# EasyEDA schematic SCH_analog_2025-01-25.json
TITLE: Sheet_1; REV: 1.0; Date: 2025-01-24; Sheet: 1/1; Drawn By: tidaschandoopasilva; Company: Your Company
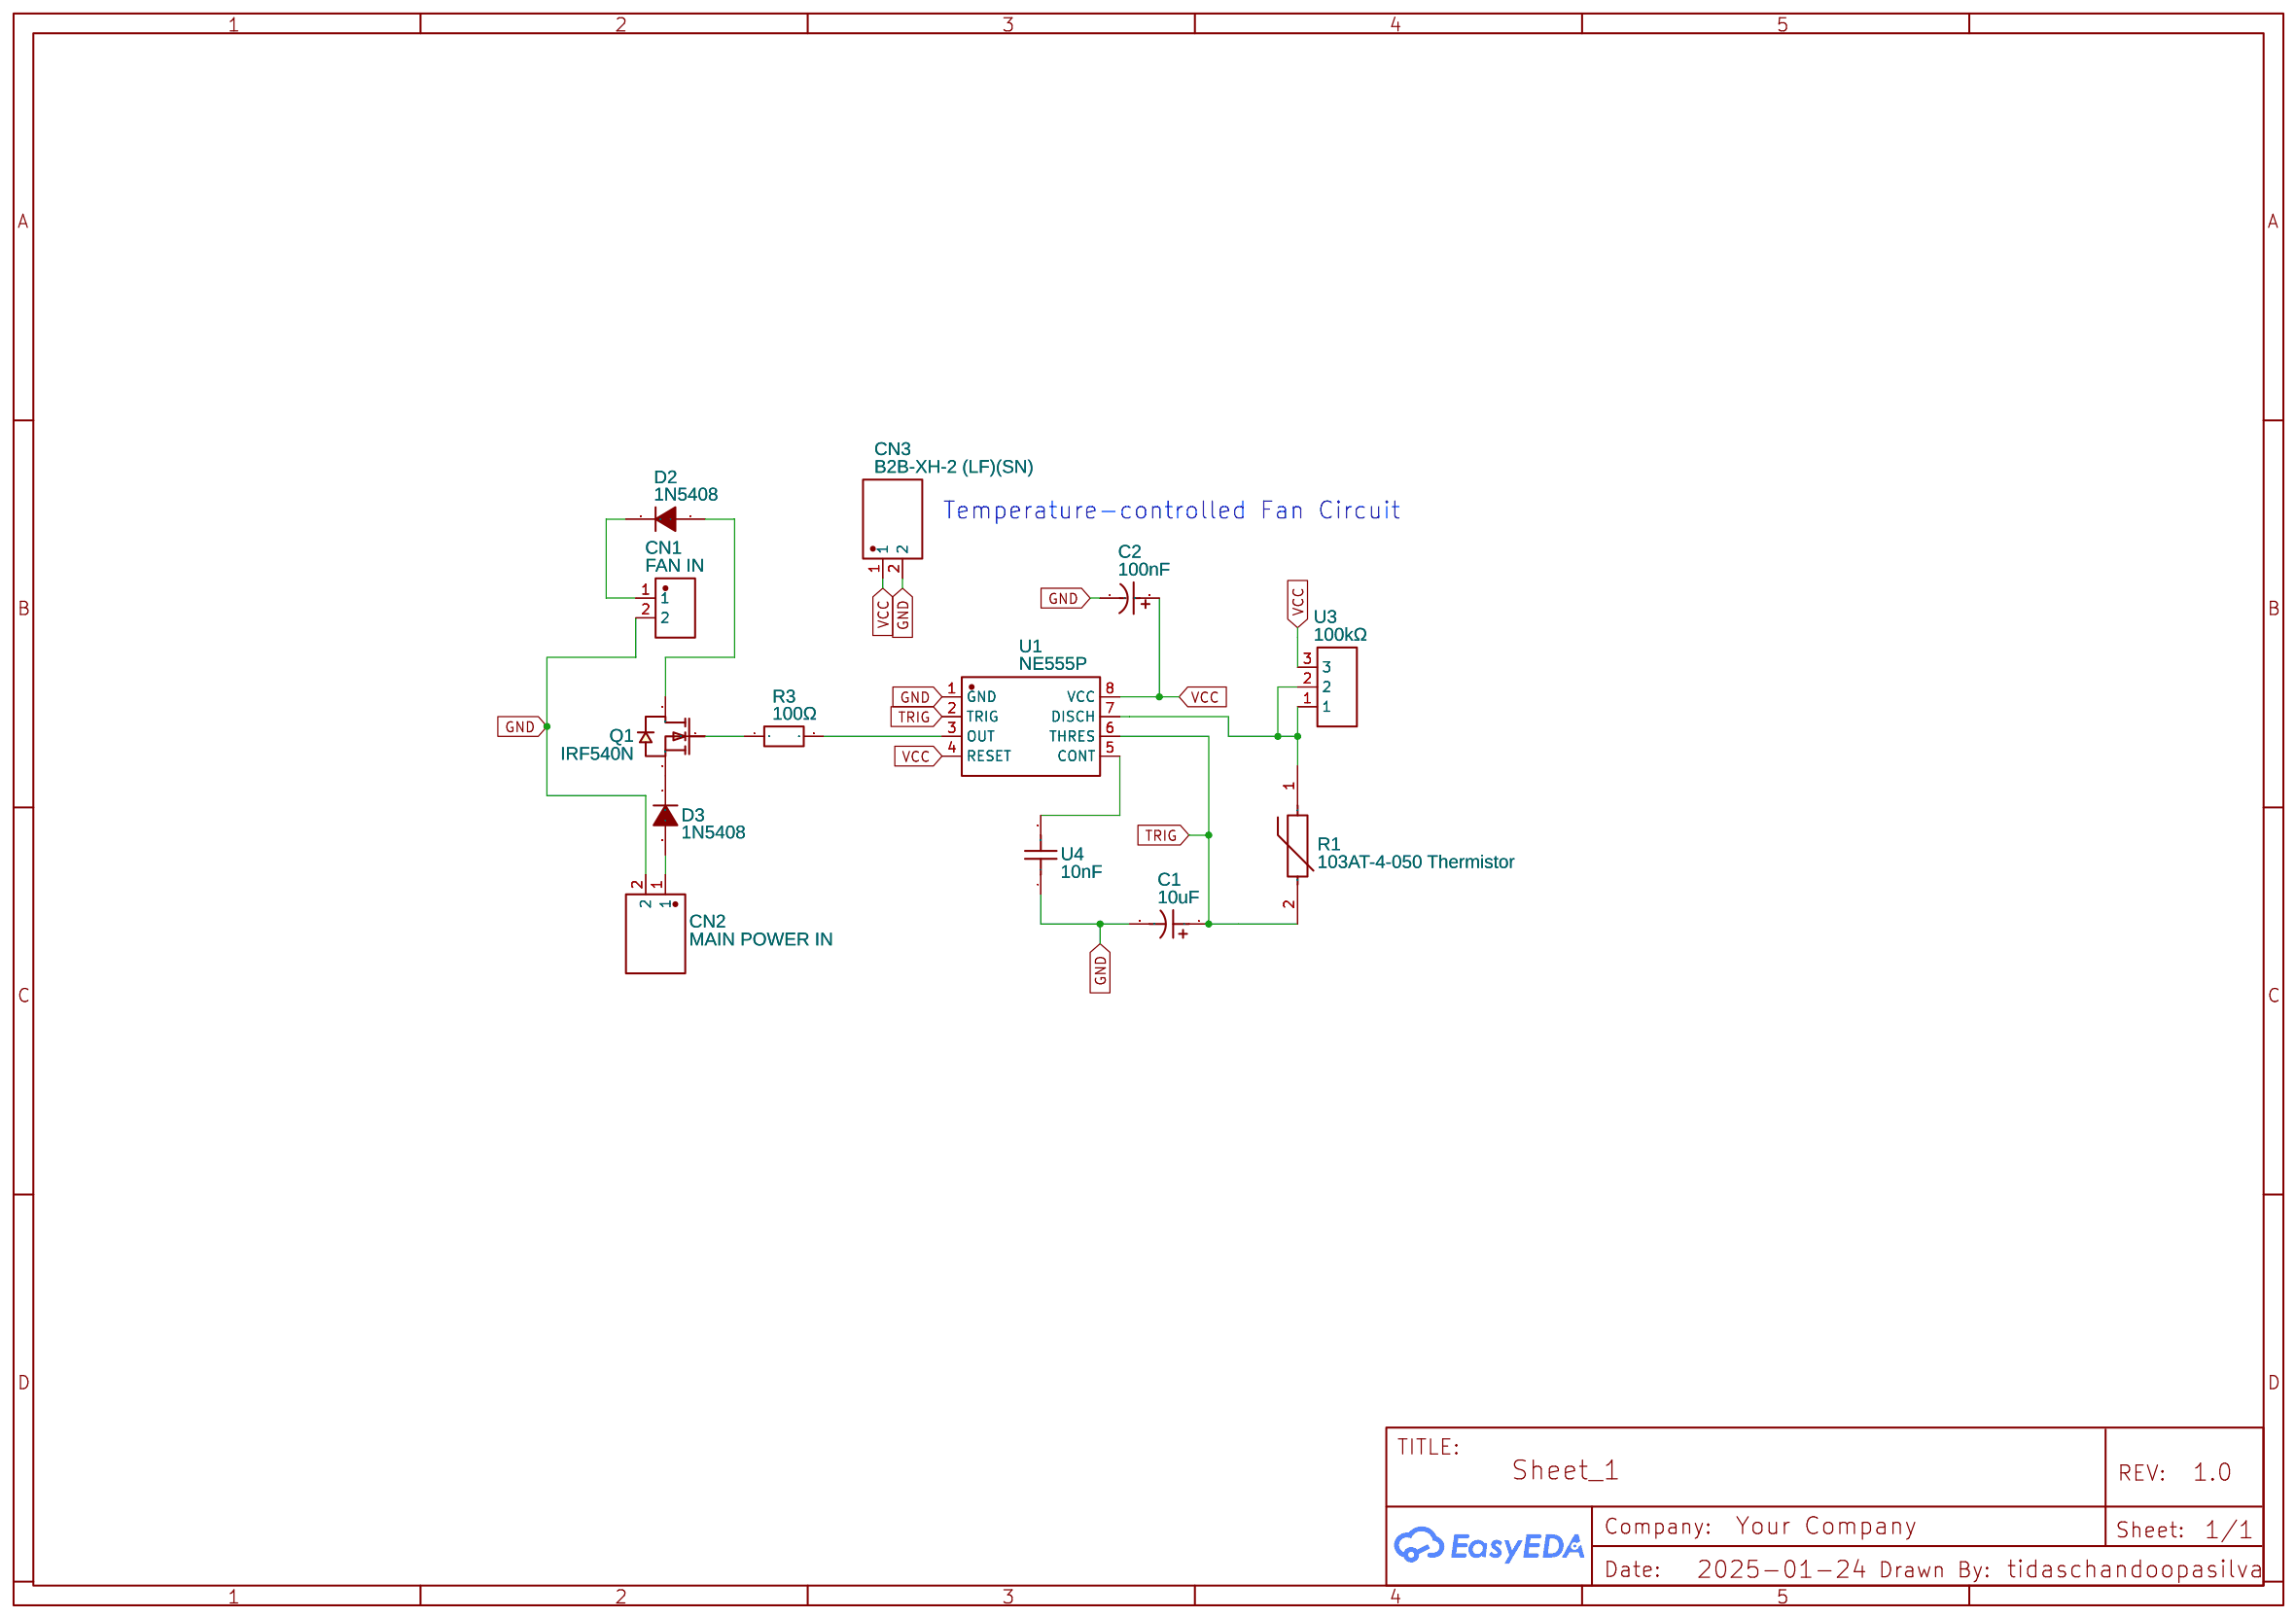
[diagram p0: schematic sheet]

## Parts
C1  10uF  [CAP-TH_BD8.0-P3.50-D0.6-FD-2]
C2  100nF  [CAP-TH_BD5.0-P2.00-D0.8-FD]
CN1  FAN IN  [CONN-TH_2P-P5.08_1729128]
CN2  MAIN POWER IN  [CONN-TH_B2B-XH-2-LF-SN]
CN3  B2B-XH-2 (LF)(SN)  [CONN-TH_B2B-XH-2-LF-SN]
D2  1N5408  [DO-201_BD5.3-L9.5-P13.50-D1.4-RD]
D3  1N5408  [DO-201_BD5.3-L9.5-P13.50-D1.4-RD]
Q1  IRF540N  [TO-220AB-3_L10.4-W4.6-P2.54-L]
R1  103AT-4-050 Thermistor  [RES-TH_L2.5-W2.5-P1.70-D0.3]
R3  100Ω  [RES-TH_BD2.4-L6.3-P10.30-D0.6]
U1  NE555P  [DIP-8_L9.8-W6.6-P2.54-LS7.6-BL]
U3  100kΩ  [RES-ADJ-TH_RK2711120026]
U4  10nF  [CAP-TH_L4.5-W2.5-P2.50-D0.5]

## Library data of the parts
C1 = KM1V101M0812: Contributor: lcsc; Supplier: LCSC; Supplier Part: C2873965; Manufacturer: ROQANG(容强)
C2 = 0.1UF 50V: Supplier: LCSC; Manufacturer: CX(承兴); Manufacturer Part: KM104M050D11RR0VH2FP0; Supplier Part: C28061; JLCPCB Part Class: Extended Part
CN1 = 1729128: Supplier: LCSC; Supplier Part: C7509570; Manufacturer: Phoenix Contact(菲尼克斯); JLCPCB Part Class: Extended Part; Contributor: lcsc
CN2 CN3 = B2B-XH-2 (LF)(SN): Contributor: LCSC; Supplier: LCSC; Supplier Part: C158014; Manufacturer: JST; Manufacturer Part: B2B-XH-2(LF)(SN); JLCPCB Part Class: Extended Part
D2 D3 = 1N5408-C2460: Supplier: LCSC; Manufacturer: MDD(辰达半导体); Supplier Part: C2460; JLCPCB Part Class: Extended Part
Q1 = IRF540N: Contributor: LCSC; Supplier: LCSC; Supplier Part: C693382; Manufacturer: VBsemi(微碧半导体); Manufacturer Part: IRF540N-VB; JLCPCB Part Class: Extended Part
R1 = 103AT-4-050: Contributor: LCSC; Supplier: LCSC; Supplier Part: C497233; Manufacturer: semitec(石冢); JLCPCB Part Class: Extended Part
R3 = RD 1/4W 100R J T/B A1: Contributor: LCSC; Supplier: LCSC; Supplier Part: C433780; Manufacturer: Tyohm(幸亚电阻); JLCPCB Part Class: Extended Part
U1 = NE555P: Supplier: LCSC; Manufacturer: TI(德州仪器); Supplier Part: C46749; JLCPCB Part Class: Extended Part
U3 = RK2711120026: Contributor: lcsc; Supplier: LCSC; Supplier Part: C470406; Manufacturer: ALPSALPINE(阿尔卑斯阿尔派); JLCPCB Part Class: Extended Part
U4 = FK14C0G1H103J: Contributor: lcsc; Supplier: LCSC; Supplier Part: C3695761; Manufacturer: TDK

## Nets
GND: C1.2 C2.2 CN1.2 CN2.2 CN3.2 U1.1(GND) U4.1
VCC: C2.1 CN3.1 U1.4(RESET) U1.8(VCC) U3.3
TRIG: C1.1 R1.2 U1.2(TRIG) U1.6(THRES)
Net-(CN1-1): CN1.1 D2.1(C)
Net-(CN2-1): CN2.1 D3.2(A)
Net-(D2-2): D2.2(A) Q1.2(D)
Net-(D3-1): D3.1(C) Q1.3(S)
Net-(Q1-1): Q1.1(G) R3.1
Net-(R1-1): R1.1 U1.7(DISCH) U3.1 U3.2
Net-(R3-2): R3.2 U1.3(OUT)
Net-(U1-5): U1.5(CONT) U4.2

## Notes on the sheet
- Temperature-controlled Fan Circuit
